# Altium schematic sheet 2_Isolation.schdoc
size 309 x 223 mm; Symbol: Sheet-Symbol_A4; Device: Sheet-Symbol_A4; Company: EasyEDA.com; Drawed: EasyEDA Pro; Reviewed: EasyEDA Pro; Version: V0.1; Page Size: A4; @Project Name: TUD-EnergyHarvestingConsole_2022-08-29_17-01-09; @Page Count: 3; @Update Date: 2023-01-06; @Create Date: 2023-01-05; @Schematic Name: Schematic2; Part Number: JLCPCB-002; @Page No: 2; @Page Name: Isolation
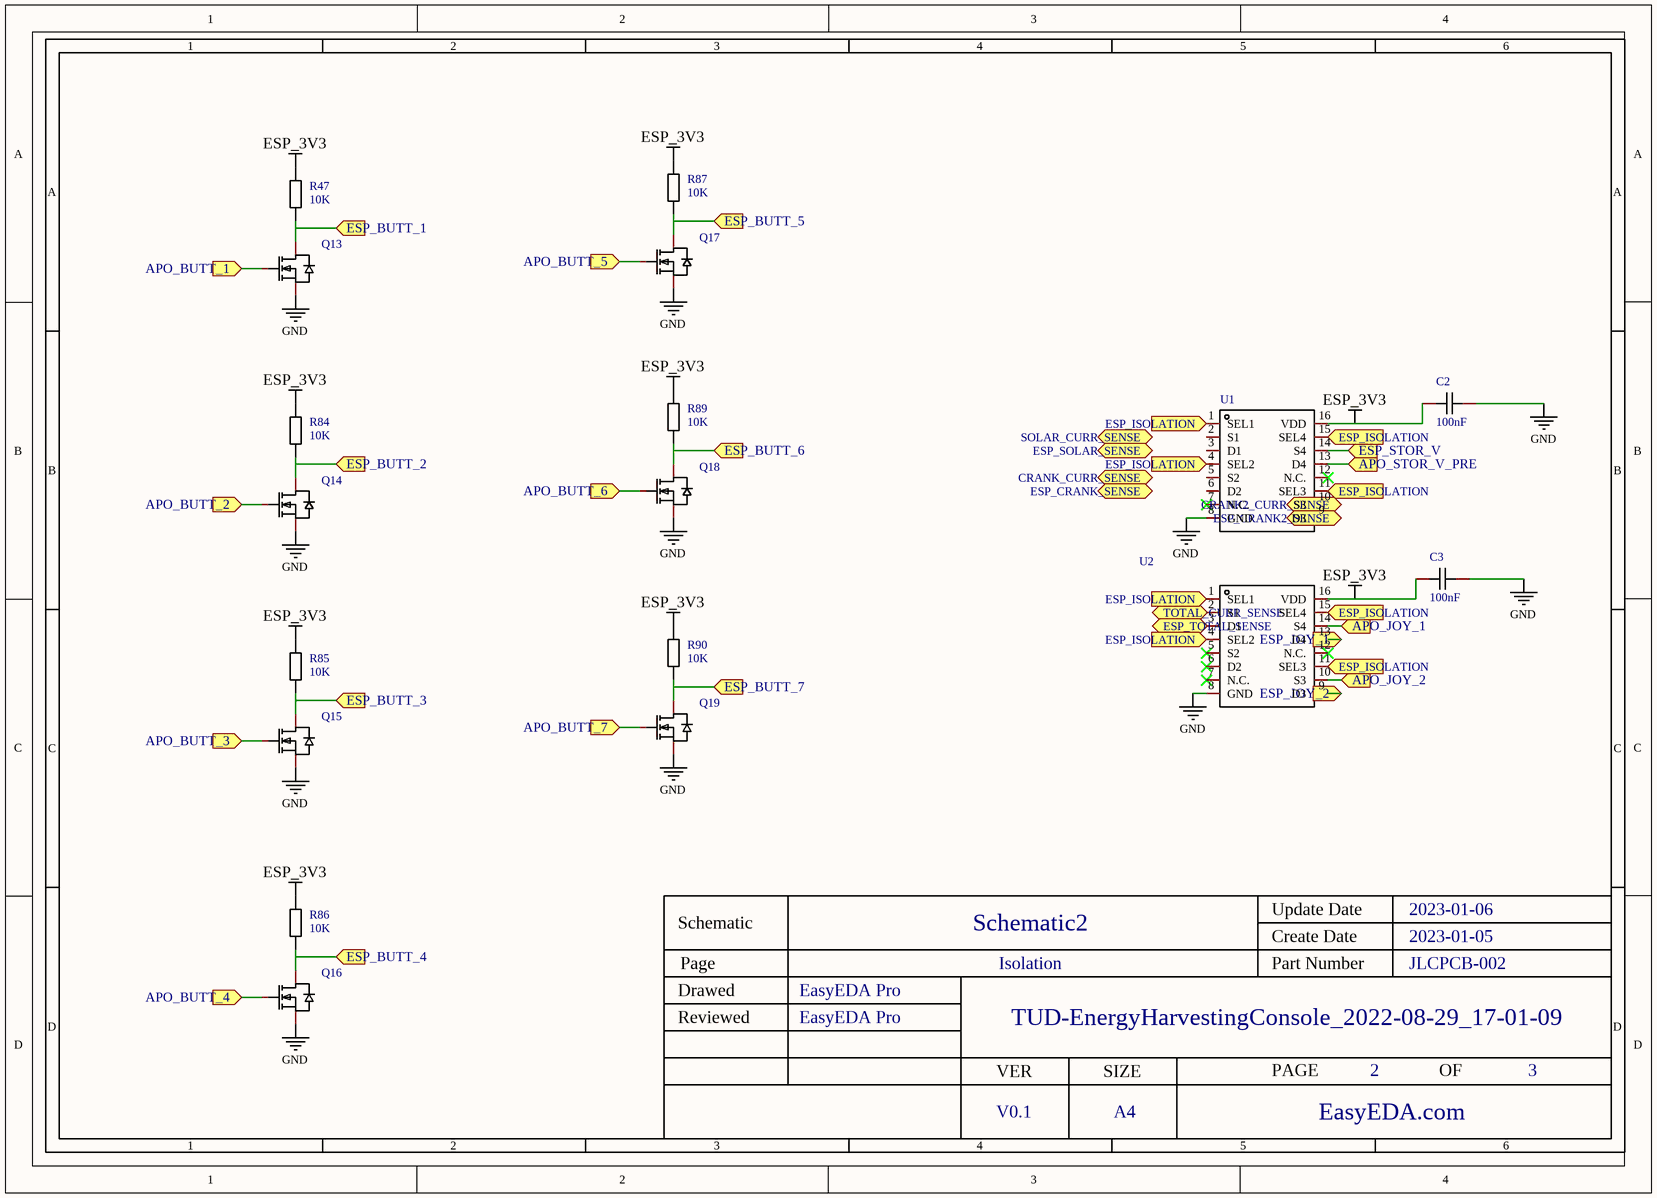
[diagram p0: 2_Isolation.schdoc]

## Parts
C2  100nF  [C0603]
C3  100nF  [C0603]
Q13  SI2302  [SOT-23-3_L2.9-W1.3-P1.90-LS2.4-BR]  (value not drawn)
Q14  SI2302  [SOT-23-3_L2.9-W1.3-P1.90-LS2.4-BR]  (value not drawn)
Q15  SI2302  [SOT-23-3_L2.9-W1.3-P1.90-LS2.4-BR]  (value not drawn)
Q16  SI2302  [SOT-23-3_L2.9-W1.3-P1.90-LS2.4-BR]  (value not drawn)
Q17  SI2302  [SOT-23-3_L2.9-W1.3-P1.90-LS2.4-BR]  (value not drawn)
Q18  SI2302  [SOT-23-3_L2.9-W1.3-P1.90-LS2.4-BR]  (value not drawn)
Q19  SI2302  [SOT-23-3_L2.9-W1.3-P1.90-LS2.4-BR]  (value not drawn)
R47  10K  [R0603]
R84  10K  [R0603]
R85  10K  [R0603]
R86  10K  [R0603]
R87  10K  [R0603]
R89  10K  [R0603]
R90  10K  [R0603]
U1  TMUX1511RSVR  [UTQFN-16_L2.6-W1.8-P0.40-BL]  (value not drawn)
U2  TMUX1511RSVR  [UTQFN-16_L2.6-W1.8-P0.40-BL]  (value not drawn)

## Ports
APO_BUTT_1 (in), APO_BUTT_2 (in), APO_BUTT_3 (in), APO_BUTT_4 (in), APO_BUTT_5 (in), APO_BUTT_6 (in), APO_BUTT_7 (in), APO_JOY_1 (in), APO_JOY_2 (in), APO_STOR_V_PRE (in), CRANK2_CURR_SENSE (bidir), CRANK_CURR_SENSE (bidir), ESP_BUTT_1 (in), ESP_BUTT_2 (in), ESP_BUTT_3 (in), ESP_BUTT_4 (in), ESP_BUTT_5 (in), ESP_BUTT_6 (in), ESP_BUTT_7 (in), ESP_CRANK2_SENSE (bidir), ESP_CRANK_SENSE (bidir), ESP_ISOLATION (in), ESP_JOY_1 (in), ESP_JOY_2 (in), ESP_SOLAR_SENSE (bidir), ESP_STOR_V (in), ESP_TOTAL_SENSE (bidir), SOLAR_CURR_SENSE (bidir), TOTAL_CURR_SENSE (bidir)

## Nets
ESP_3V3: C2.2 C3.1 R47.1 R84.1 R85.1 R86.1 R87.1 R89.1 R90.1 U1.16(VDD) U2.16(VDD)
GND: C2.1 C3.2 Q13.2(S) Q14.2(S) Q15.2(S) Q16.2(S) Q17.2(S) Q18.2(S) Q19.2(S) U1.8(GND) U2.8(GND)
APO_BUTT_1: Q13.1(G) ; port APO_BUTT_1
APO_BUTT_2: Q14.1(G) ; port APO_BUTT_2
APO_BUTT_3: Q15.1(G) ; port APO_BUTT_3
APO_BUTT_4: Q16.1(G) ; port APO_BUTT_4
APO_BUTT_5: Q17.1(G) ; port APO_BUTT_5
APO_BUTT_6: Q18.1(G) ; port APO_BUTT_6
APO_BUTT_7: Q19.1(G) ; port APO_BUTT_7
APO_JOY_1: U2.14(S4) ; port APO_JOY_1
APO_JOY_2: U2.10(S3) ; port APO_JOY_2
APO_STOR_V_PRE: U1.13(D4) ; port APO_STOR_V_PRE
ESP_BUTT_1: Q13.3(D) R47.2 ; port ESP_BUTT_1
ESP_BUTT_2: Q14.3(D) R84.2 ; port ESP_BUTT_2
ESP_BUTT_3: Q15.3(D) R85.2 ; port ESP_BUTT_3
ESP_BUTT_4: Q16.3(D) R86.2 ; port ESP_BUTT_4
ESP_BUTT_5: Q17.3(D) R87.2 ; port ESP_BUTT_5
ESP_BUTT_6: Q18.3(D) R89.2 ; port ESP_BUTT_6
ESP_BUTT_7: Q19.3(D) R90.2 ; port ESP_BUTT_7
ESP_ISOLATION: U1.1(SEL1) U1.4(SEL2) U1.11(SEL3) U1.15(SEL4) U2.1(SEL1) U2.4(SEL2) U2.11(SEL3) U2.15(SEL4) ; port ESP_ISOLATION
ESP_JOY_1: U2.13(D4) ; port ESP_JOY_1
ESP_JOY_2: U2.9(D3) ; port ESP_JOY_2
ESP_STOR_V: U1.14(S4) ; port ESP_STOR_V

Not connected (* = marked no-connect by the designer): U1 2(S1) 3(D1) 5(S2) 6(D2) 7(N.C.)* 9(D3) 10(S3) 12(N.C.)*; U2 2(S1) 3(D1) 5(S2)* 6(D2)* 7(N.C.)* 12(N.C.)*

## Notes on the sheet
- 1
- 2
- 3
- 4
- 5
- 6
- A
- B
- C
- Schematic
- Schematic2
- Create Date
- Update Date
- 2023-01-06
- 2023-01-05
- Reviewed
- Drawed
- Page
- EasyEDA Pro
- Isolation
- Part Number
- TUD-EnergyHarvestingConsole_2022-08-29_17-01-09
- JLCPCB-002
- D
- VER
- SIZE
- PAGE
- OF
- V0.1
- A4
- EasyEDA.com

## Library data of the parts
C2 C3 = CC0603KRX7R9BB104: Manufacturer: YAGEO; Convert to PCB: yes; NAME: 2; Name: 100nF; Symbol: 100nF; Device: CC0603KRX7R9BB104; Supplier: LCSC; Manufacturer Part: CC0603KRX7R9BB104; Supplier Part: C14663; JLCPCB Part Class: Basic; Add into BOM: yes; Origin Footprint: C0603; NUMBER: 2
Q13-Q19 = SI2302: Manufacturer: YONGYUTAI(永裕泰); Symbol: SI2302_C2891732; Add into BOM: yes; Device: SI2302; LCSC Part Name: SI2302; Supplier Part: C2891732; Manufacturer Part: SI2302; Supplier Footprint: SOT-23; JLCPCB Part Class: Extended Part; Datasheet: https://atta.szlcsc.com/upload/public/pdf/source/20210901/467BBA277A18343FF82D7D641AA41F7C.pdf; Supplier: LCSC; Convert to PCB: yes
R47 = 0603WAF1002T5E: Manufacturer: UniOhm; Convert to PCB: yes; Name: 10K; Symbol: 10K; Device: 0603WAF1002T5E; Supplier: LCSC; Manufacturer Part: 0603WAF1002T5E; Supplier Part: C25804; JLCPCB Part Class: Basic; Add into BOM: yes; Origin Footprint: R0603
R84-R87 R89 R90 = 0603WAF1002T5E: Manufacturer: UniOhm; Convert to PCB: yes; NAME: 1; Name: 10K; Symbol: 10K; Device: 0603WAF1002T5E; Supplier: LCSC; Manufacturer Part: 0603WAF1002T5E; Supplier Part: C25804; JLCPCB Part Class: Basic; Add into BOM: yes; Origin Footprint: R0603; NUMBER: 1
U1 U2 = TMUX1511RSVR: Switch Circuit:-; Manufacturer: TI(德州仪器); Add into BOM: yes; Name: TMUX1511RSVR; Symbol: TMUX1511RSVR; Device: TMUX1511RSVR; LCSC Part Name: TMUX1511RSVR; Supplier Part: C2673275; Manufacturer Part: TMUX1511RSVR; Supplier Footprint: UTQFN-16(1.8x2.6); JLCPCB Part Class: Extended Part; Supplier: LCSC; Convert to PCB: yes; Switch Circuit: -